# EAGLE design singleDiode (EAGLE 7.4.0)
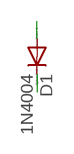
[diagram p0: schematic, sheet 1]

## Parts
D1  1N4004  [DO41-10]

## Nets
ANODE: D1.A
CATHODE: D1.C

## Library data of the parts
D1 = diode:1N4004: DIODE general purpose rectifier, 1 A

## Board
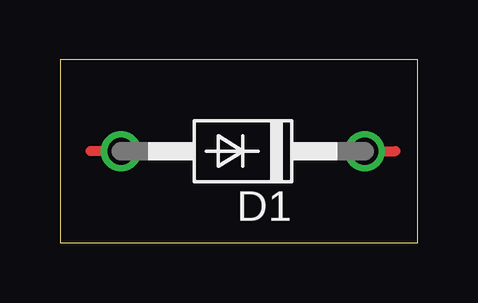
[diagram p1: board, top side]

Size 14.91 x 7.61 mm. Coordinates in mm from the lower left corner, seen from the top.
Outline: 0,0 14.91,0 14.91,7.61 0,7.61 0,0
Copper layers (1*16): Top 0.035mm / dielectric 1.5mm / Bottom 0.035mm
Design rules "default": minimum track width 10mil, minimum drill 24mil, track to track 8mil, track to pad 8mil, pad to pad 8mil, via to via 8mil, smd to smd 8mil, copper to edge 40mil, drill to drill 8mil, minimum pad ring 10mil, minimum via ring 8mil, stop-mask expansion 4mil, vias tented up to drill 0mil, thermal gap 10mil

### Footprints (pad centres in the part's own frame; a part is rotated, then mirrored left to right if it is on the bottom)
DO41-10 = drill 1.118: A 5.08,0; C -5.08,0

### Placement (x,y rotation side)
D1  7.62,3.81 180 top

### Tracks (layer width: path | path; a pad name or v marks a point on that pad's centre or on a via)
ANODE
  Top 0.406: D1.A 1.27,3.81
CATHODE
  Top 0.406: D1.C 13.97,3.81